# EAGLE schematic solar WiFi weather station (EAGLE 9.6.2)
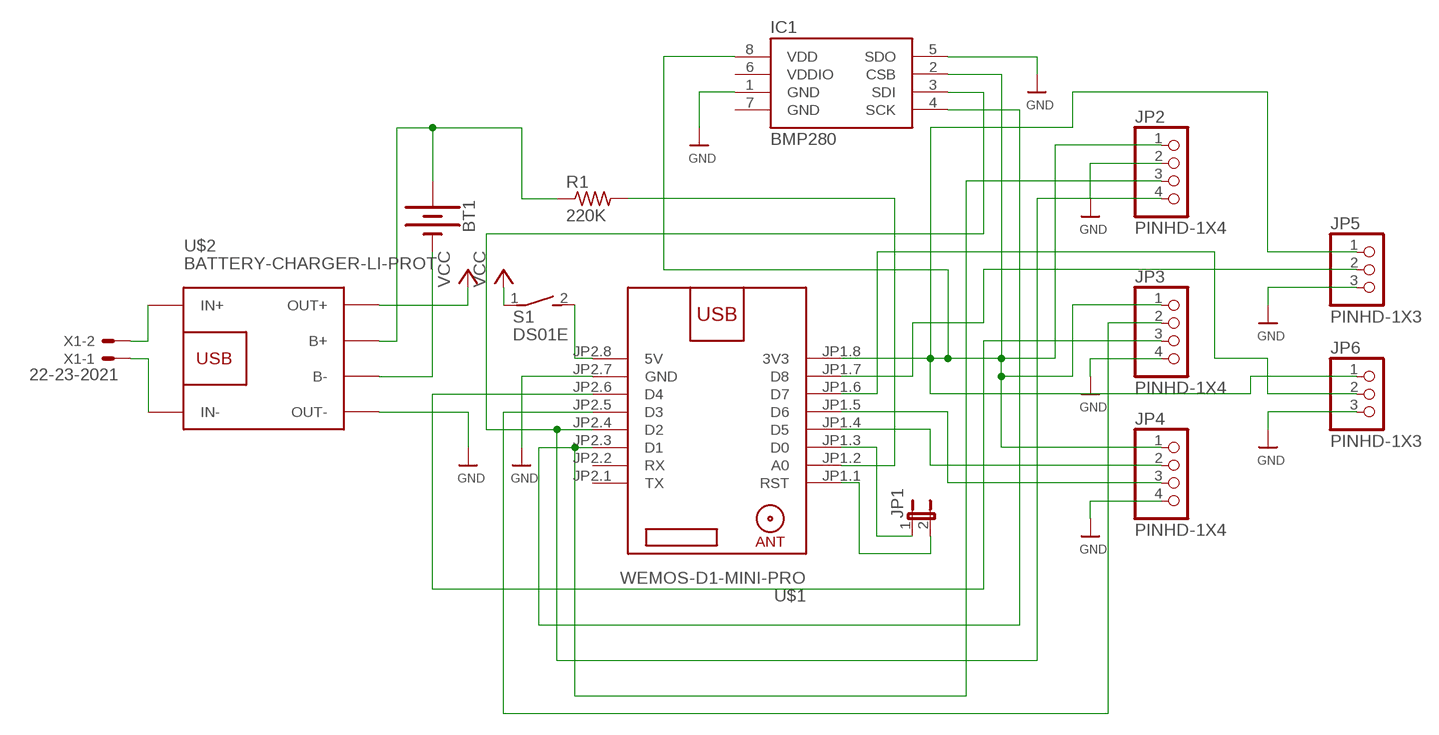
[diagram p0: schematic, sheet 1]

## Parts
BT1  BATTERY-AAA  [BATTERY-AAA]
IC1  BMP280  [BMP280]
JP1  JP1E  [JP1]
JP2  PINHD-1X4  [1X04]
JP3  PINHD-1X4  [1X04]
JP4  PINHD-1X4  [1X04]
JP5  PINHD-1X3  [1X03]
JP6  PINHD-1X3  [1X03]
R1  220K  R-US_0204/7  [0204/7]
S1  DS01E  [DS-01]
U$1  WEMOS-D1-MINI-PRO  [WEMOS-D1-MINI-PRO]
U$2  BATTERY-CHARGER-LI-PROT  [BATTERY-CHARGER-LI-PROT]
X1  22-23-2021  [22-23-2021]

## Nets
GND: IC1.1(GND) IC1.5(SDO) JP2.2 JP3.4 JP4.4 JP5.3 JP6.3 U$1.JP2.7(GND) U$2.OUT-
N$1: U$2.IN+ X1.2
N$2: U$2.IN- X1.1
N$3: BT1.PWR@1(+) R1.1 U$2.B+
N$4: BT1.GND@1(-) U$2.B-
N$5: R1.2 U$1.JP1.2(A0)
N$6: JP1.1 U$1.JP1.3(D0)
N$7: JP1.2 U$1.JP1.1(RST)
N$8: S1.2 U$1.JP2.8(5V)
N$9: JP3.2 U$1.JP2.5(D3)
N$10: IC1.2(CSB) IC1.8(VDD) JP2.1 JP3.1 JP4.1 JP5.1 JP6.1 U$1.JP1.8(3V3)
N$11: IC1.4(SCK) JP2.3 U$1.JP2.3(D1)
N$12: JP3.3 U$1.JP2.6(D4)
N$13: IC1.3(SDI) JP2.4 U$1.JP2.4(D2)
N$14: JP4.2 U$1.JP1.4(D5)
N$15: JP4.3 U$1.JP1.5(D6)
N$16: JP6.2 U$1.JP1.6(D7)
N$17: JP5.2 U$1.JP1.7(D8)
VCC: S1.1 U$2.OUT+
Unconnected: IC1.6(VDDIO) U$1.JP2.1(TX) U$1.JP2.2(RX)

## Power pins joined to a net without a drawn wire
GND: IC1.7(GND)

## Library data of the parts
BT1 = SparkFun-Batteries:BATTERY: Battery - Single Cell A variety of battery chemistries, sizes, and footprints. Device List: 20MM_PTH - Coin Cell Battery Holder - 20mm (PTH) <https://www.sparkfun.com/products/783> 6.8MM_PTH - Coin Cell Battery Holder - 6.8MM(SMD) <https://www.digikey.com/product-detail/en/seiko-instruments/MS621FE-FL11E/728-1057-ND/1889208?WT.srch=1&gclid=CNOQ5a6LzdQCFZS2wAodXCkE0g> 12MM_SMD - Coin Cell Battery Holder - 12mm (SMD) <https://www.sparkfun.com/products/10592> 12MM_PTH - Coin Cell Battery Holder - 12mm (PTH) <https://www.sparkfun.com/products/7948> 20MM_SMD - 20mm Coin Cell Battery Holder (SMD) (2 legs) Used on the Big Time Watch Kit <https://www.sparkfun.com/products/11734> 20MM_SMD_4LEGS - Coin Cell Battery Holder - 20mm (SMD) <https://www.sparkfun.com/products/11892> 20MM_SMD_4LEGS_OVERPASTE - Coin Cell Battery Holder - 20mm (SMD) <https://www.sparkfun.com/products/11892> (Over-paste on the legs) 24.5MM_PTH - Coin Cell Battery Holder - 24.5mm (PTH) <https://www.sparkfun.com/products/8863> 9V - 9V Battery Holder - PC Mount Used on the SparkFun SparkPunk Sound Kit <https://www.sparkfun.com/products/11177> and SparkFun SparkPunk Sequencer Kit <https://www.sparkfun.com/products/12707> 18650 - Battery Holder - 18650 (PTH) <https://www.sparkfun.com/products/13113> AA - Battery Holder - 1xAA (PTH) <https://www.sparkfun.com/products/7949> AAA - Battery Holder - 1xAAA (PTH) <https://www.sparkfun.com/products/12718> AA_KIT - Battery Holder - 1xAA (PTH) <https://www.sparkfun.com/products/7949> Special kit package - pads only have exposed copper on one side of the board. AAA_KIT - Battery Holder - 1xAAA (PTH) <https://www.sparkfun.com/products/12718> Special kit package - pads only have exposed copper on one side of the board.; PROD_ID: BATT-08571; SF_SKU: PRT-12718
IC1 = BeagleBone_Blue_R3:BMP280: BOSCH BMP280 Digital Pressure Sensor
JP1 = jumper:JP1E: JUMPER
JP2-JP4 = Connector:PINHD-1X4: PIN HEADER; CATEGORY: CONNECTOR; SUB-CATEGORY: PIN-HEADER
JP5 JP6 = Connector:PINHD-1X3: PIN HEADER; CATEGORY: CONNECTOR; SUB-CATEGORY: PIN-HEADER
R1 = rcl:R-US_: RESISTOR, American symbol; SPICEPREFIX: R
S1 = Switch:DS01E: DIL/CODE SWITCH; CATEGORY: SWITCH; TYPE: SPST
U$1 = diy-modules:WEMOS-D1-MINI-PRO: WEMOS D1 mini Pro: Mini Wi-Fi Board based on ESP-8266EX chip More details can be found here: https://www.wemos.cc/product/d1-mini-pro.html Click here to find device on ebay.com <http://www.ebay.com/sch/wemos+d1+mini+pro>
U$2 = diy-modules:BATTERY-CHARGER-LI-PROT: Lithium Battery 5V Charger with protection circuit More details available here: http://www.instructables.com/id/DIY-Lithium-ion-Battery-Charger/step4/TP4056-based-lithium-ion-battery-charger-module/ Click here to find device on ebay.com <http://www.ebay.com/sch/tp4056+charger+usb+protection>
X1 = con-molex:22-23-2021: .100" (2.54mm) Center Header - 2 Pin; MF: MOLEX; MPN: 22-23-2021; OC_FARNELL: 1462926; OC_NEWARK: 25C3832

## Net classes
0 default: width 0.305 mm, drill 0.508 mm, clearance 0.254 mm